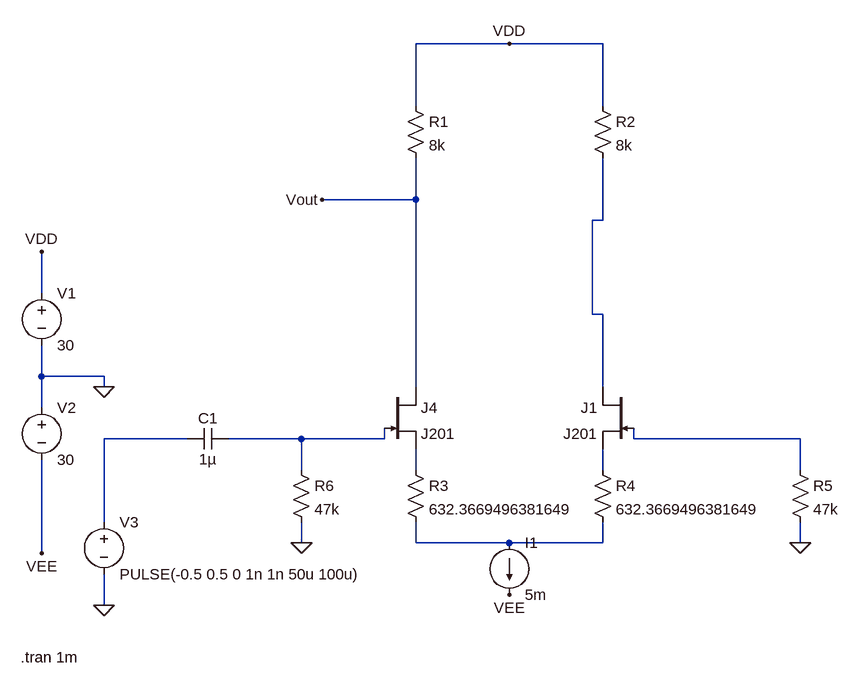
[diagram p0: schematic 1E_J201_THD.asc]
1E_J201_THD.asc, the LTspice schematic file:
Version 4
SHEET 1 936 680
WIRE 160 -448 16 -448
WIRE 304 -448 160 -448
WIRE 16 -352 16 -448
WIRE 304 -352 304 -448
WIRE 16 -208 16 -272
WIRE 16 -208 -128 -208
WIRE 304 -176 304 -272
WIRE 304 -176 288 -176
WIRE -560 -64 -560 -128
WIRE 288 -32 288 -176
WIRE 304 -32 288 -32
WIRE -560 64 -560 16
WIRE -464 64 -560 64
WIRE -464 80 -464 64
WIRE 16 80 16 -208
WIRE 304 80 304 -32
WIRE -560 112 -560 64
WIRE -336 160 -464 160
WIRE -160 160 -272 160
WIRE -32 160 -32 144
WIRE -32 160 -160 160
WIRE 352 160 352 144
WIRE 608 160 352 160
WIRE -160 208 -160 160
WIRE 16 208 16 176
WIRE 304 208 304 176
WIRE 608 208 608 160
WIRE -464 288 -464 160
WIRE -160 320 -160 288
WIRE 16 320 16 288
WIRE 160 320 16 320
WIRE 304 320 304 288
WIRE 304 320 160 320
WIRE 608 320 608 288
WIRE -560 336 -560 192
WIRE -464 416 -464 368
FLAG -560 -128 VDD
FLAG -560 336 VEE
FLAG 160 -448 VDD
FLAG 160 400 VEE
FLAG -464 80 0
FLAG -464 416 0
FLAG 608 320 0
FLAG -128 -208 Vout
FLAG -160 320 0
SYMBOL current 160 320 R0
WINDOW 123 0 0 Left 0
WINDOW 39 0 0 Left 0
SYMATTR InstName I1
SYMATTR Value 5m
SYMBOL voltage -560 -80 R0
WINDOW 123 0 0 Left 0
WINDOW 39 0 0 Left 0
SYMATTR InstName V1
SYMATTR Value 30
SYMBOL voltage -560 96 R0
WINDOW 123 0 0 Left 0
WINDOW 39 0 0 Left 0
SYMATTR InstName V2
SYMATTR Value 30
SYMBOL res 0 -368 R0
SYMATTR InstName R1
SYMATTR Value 8k
SYMBOL res 288 -368 R0
SYMATTR InstName R2
SYMATTR Value 8k
SYMBOL voltage -464 272 R0
WINDOW 123 0 0 Left 0
WINDOW 39 0 0 Left 0
SYMATTR InstName V3
SYMATTR Value PULSE(-0.5 0.5 0 1n 1n 50u 100u)
SYMBOL res 0 192 R0
SYMATTR InstName R3
SYMATTR Value 632.3669496381649
SYMBOL res 288 192 R0
SYMATTR InstName R4
SYMATTR Value 632.3669496381649
SYMBOL res 592 192 R0
SYMATTR InstName R5
SYMATTR Value 47k
SYMBOL njf 352 80 M0
SYMATTR InstName J1
SYMATTR Value J201
SYMBOL njf -32 80 R0
SYMATTR InstName J4
SYMATTR Value J201
SYMBOL res -176 192 R0
SYMATTR InstName R6
SYMATTR Value 47k
SYMBOL cap -272 144 R90
WINDOW 0 0 32 VBottom 2
WINDOW 3 32 32 VTop 2
SYMATTR InstName C1
SYMATTR Value 1µ
TEXT -592 496 Left 2 !.tran 1m

The netlist it stands for:
* 1E_J201_THD.asc
I1 N007 VEE 5m
V1 VDD 0 30
V2 0 VEE 30
R1 VDD Vout 8k
R2 VDD N001 8k
V3 N002 0 PULSE(-0.5 0.5 0 1n 1n 50u 100u)
R3 N005 N007 632.3669496381649
R4 N006 N007 632.3669496381649
R5 N004 0 47k
J1 N001 N004 N006 J201
J4 Vout N003 N005 J201
R6 N003 0 47k
C1 N003 N002 1µ
.model NJF NJF
.model PJF PJF
.lib standard.jft
.tran 1m
.backanno
.end